# Altium schematic sheet Sheet1.SchDoc
size A; SheetNumber: 1; SheetTotal: 1
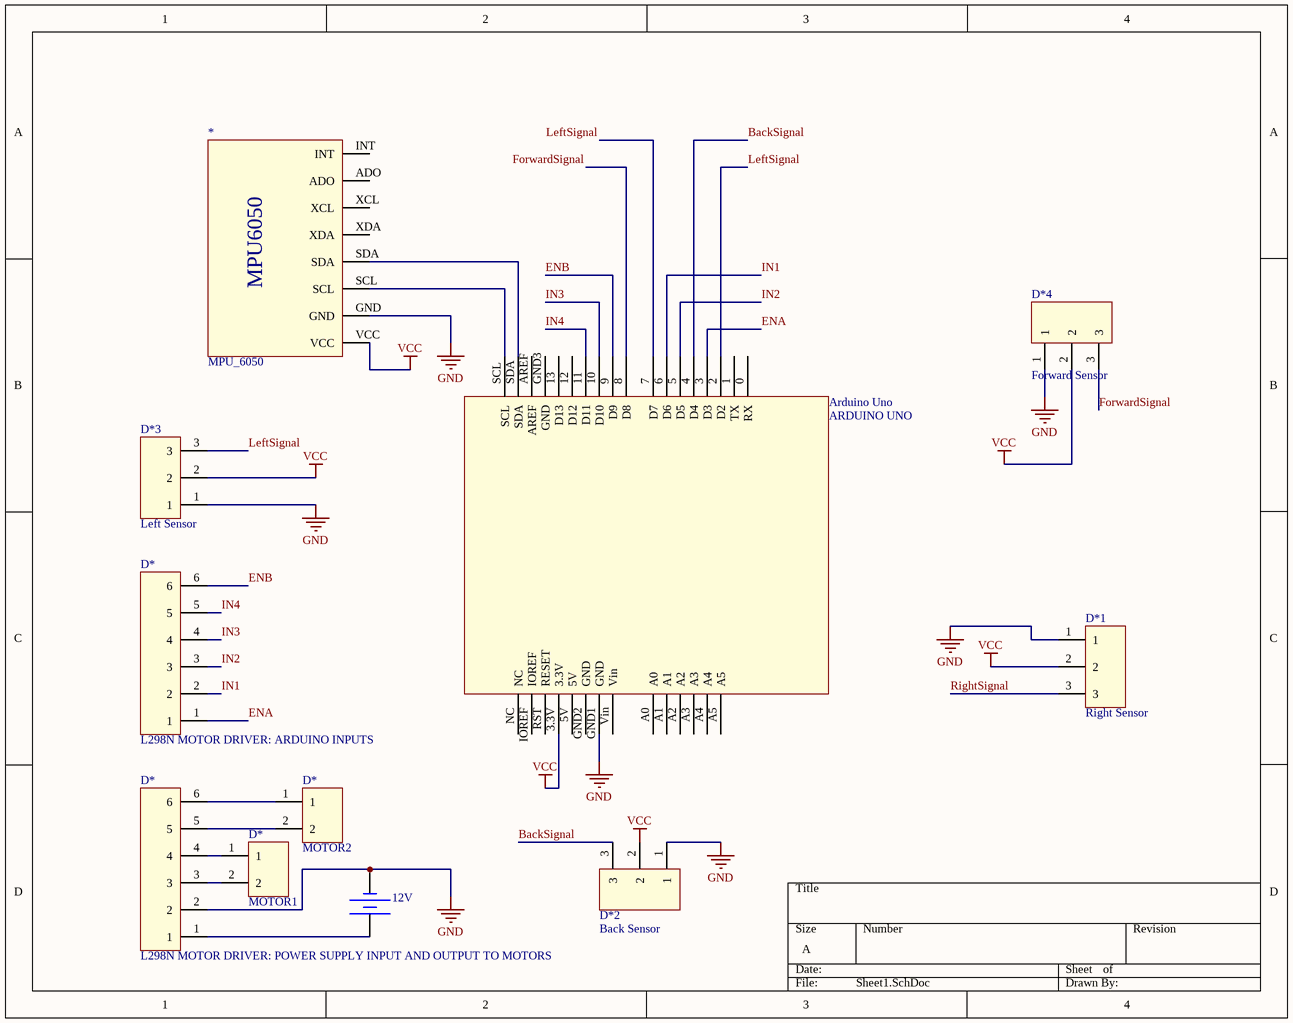
[diagram p0: Sheet1.SchDoc]

## Parts
(Parts that share a designator on the sheet are numbered #1, #2 ... from top to bottom, then left to right.)
12V  Constant Voltage Source  (value not drawn)
*  MPU_6050  [MPU6050]
Arduino_Uno  ARDUINO UNO  [ARDUINO UNO]
D*1  Right Sensor  [DATA_PIN_HEADER_3_2.54m]
D*2  Back Sensor  [DATA_PIN_HEADER_3_2.54m]
D*3  Left Sensor  [DATA_PIN_HEADER_3_2.54m]
D*4  Forward Sensor  [DATA_PIN_HEADER_3_2.54m]
D*#1  L298N MOTOR DRIVER: ARDUINO INPUTS  [DATA_PIN_HEADER_6_2.54m]
D*#2  MOTOR2  [DATA_PIN_HEADER_2_2.54m]
D*#3  L298N MOTOR DRIVER: POWER SUPPLY INPUT AND OUTPUT TO MOTORS  [DATA_PIN_HEADER_6_2.54m]
D*#4  MOTOR1  [DATA_PIN_HEADER_2_2.54m]

## Nets
GND: 12V.2 *.GND Arduino_Uno.GND1(GND) D*1.1 D*2.1 D*3.1 D*4.1 D*#3.2
VCC: *.VCC Arduino_Uno.3.3V D*1.2 D*2.2 D*3.2 D*4.2
BackSignal: Arduino_Uno.4(D4) D*2.3
ENA: Arduino_Uno.3(D3) D*#1.1
ENB: Arduino_Uno.9(D9) D*#1.6
ForwardSignal: Arduino_Uno.8(D8) D*4.3
IN1: Arduino_Uno.6(D6) D*#1.2
IN2: Arduino_Uno.5(D5) D*#1.3
IN3: Arduino_Uno.10(D10) D*#1.4
IN4: Arduino_Uno.11(D11) D*#1.5
LeftSignal: Arduino_Uno.2(D2) Arduino_Uno.7(D7) D*3.3
RightSignal: D*1.3
Net12V_1: 12V.1 D*#3.1
Net*_SCL: *.SCL Arduino_Uno.SCL
Net*_SDA: *.SDA Arduino_Uno.SDA
NetD*#2_1: D*#2.1 D*#3.6
NetD*#2_2: D*#2.2 D*#3.5
NetD*#3_3: D*#3.3 D*#4.2
NetD*#3_4: D*#3.4 D*#4.1

Not connected (* = marked no-connect by the designer): * ADO INT XCL XDA; Arduino_Uno 0(RX) 1(TX) 5V 12(D12) 13(D13) A0 A1 A2 A3 A4 A5 AREF GND2(GND) GND3(GND) IOREF NC RST(RESET) Vin

## Notes on the sheet
- (in symbol MPU_6050) MPU6050

## Library data of the parts
12V = Battery: SimulationGenericComponent: True
D*1-D*4 = DATA_PIN_HEADER_3_2.54m
D*#1 D*#3 = DATA_PIN_HEADER_6_2.54m
D*#2 D*#4 = DATA_PIN_HEADER_2_2.54m